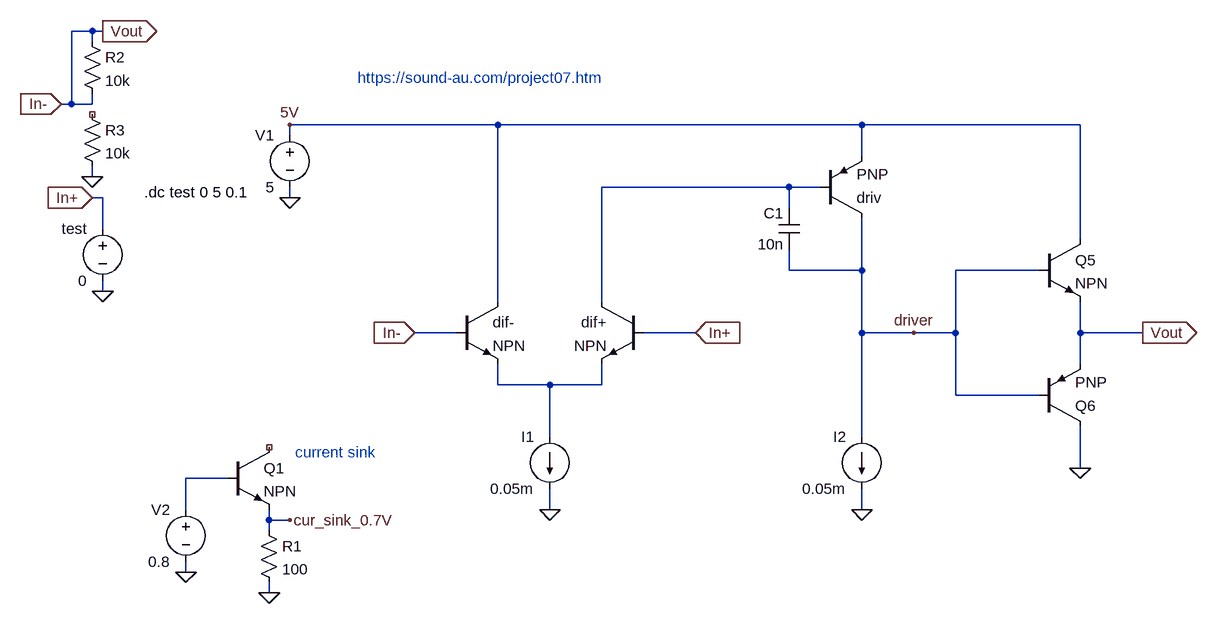
[diagram p0: schematic ideal_simple.asc]
ideal_simple.asc, the LTspice schematic file:
Version 4
SHEET 1 1104 680
WIRE -688 -384 -720 -384
WIRE -672 -384 -688 -384
WIRE -688 -368 -688 -384
WIRE -720 -272 -720 -384
WIRE -720 -272 -736 -272
WIRE -688 -272 -688 -288
WIRE -688 -272 -720 -272
WIRE -64 -240 -384 -240
WIRE 496 -240 -64 -240
WIRE 832 -240 496 -240
WIRE -384 -224 -384 -240
WIRE 496 -192 496 -240
WIRE -688 -160 -688 -176
WIRE 384 -144 96 -144
WIRE 432 -144 384 -144
WIRE -672 -128 -688 -128
WIRE -384 -128 -384 -144
WIRE 384 -112 384 -144
WIRE -672 -80 -672 -128
WIRE 832 -64 832 -240
WIRE 384 -16 384 -48
WIRE 496 -16 496 -96
WIRE 496 -16 384 -16
WIRE 768 -16 640 -16
WIRE -672 16 -672 0
WIRE -64 32 -64 -240
WIRE 96 32 96 -144
WIRE -128 80 -192 80
WIRE 240 80 160 80
WIRE 496 80 496 -16
WIRE 576 80 496 80
WIRE 640 80 640 -16
WIRE 640 80 576 80
WIRE 832 80 832 32
WIRE 928 80 832 80
WIRE 832 128 832 80
WIRE -64 160 -64 128
WIRE 16 160 -64 160
WIRE 96 160 96 128
WIRE 96 160 16 160
WIRE 640 176 640 80
WIRE 768 176 640 176
WIRE 16 240 16 160
WIRE 496 240 496 80
WIRE 832 288 832 224
WIRE -480 304 -544 304
WIRE -544 352 -544 304
WIRE 16 352 16 320
WIRE 496 352 496 320
WIRE -416 368 -416 352
WIRE -384 368 -416 368
WIRE -416 384 -416 368
WIRE -544 448 -544 432
WIRE -416 480 -416 464
FLAG -384 -128 0
FLAG -384 -240 5V
FLAG -384 368 cur_sink_0.7V
FLAG -416 480 0
FLAG -544 448 0
FLAG 832 288 0
FLAG 16 352 0
FLAG 496 352 0
FLAG 928 80 Vout
IOPIN 928 80 Out
FLAG -192 80 In-
IOPIN -192 80 In
FLAG 240 80 In+
IOPIN 240 80 In
FLAG -736 -272 In-
IOPIN -736 -272 In
FLAG -688 -128 In+
IOPIN -688 -128 In
FLAG -672 -384 Vout
IOPIN -672 -384 Out
FLAG -672 16 0
FLAG -688 -160 0
FLAG 576 80 driver
SYMBOL npn -480 256 R0
SYMATTR InstName Q1
SYMBOL res -432 368 R0
SYMATTR InstName R1
SYMATTR Value 100
SYMBOL voltage -384 -240 M0
SYMATTR InstName V1
SYMATTR Value 5
SYMBOL voltage -544 336 M0
SYMATTR InstName V2
SYMATTR Value 0.8
SYMBOL npn -128 32 R0
SYMATTR InstName dif-
SYMBOL npn 160 32 M0
SYMATTR InstName dif+
SYMBOL pnp 432 -96 M180
SYMATTR InstName driv
SYMBOL cap 400 -112 M0
SYMATTR InstName C1
SYMATTR Value 10n
SYMBOL npn 768 -64 R0
SYMATTR InstName Q5
SYMBOL pnp 768 224 M180
SYMATTR InstName Q6
SYMBOL current 16 240 M0
SYMATTR InstName I1
SYMATTR Value 0.05m
SYMBOL current 496 240 M0
SYMATTR InstName I2
SYMATTR Value 0.05m
SYMBOL voltage -672 -96 M0
SYMATTR InstName test
SYMATTR Value 0
SYMBOL res -704 -384 R0
SYMATTR InstName R2
SYMATTR Value 10k
SYMBOL res -704 -272 R0
SYMATTR InstName R3
SYMATTR Value 10k
TEXT -376 264 Left 2 ;current sink
TEXT -608 -136 Left 2 !.dc test 0 5 0.1
TEXT -280 -312 Left 2 ;https://sound-au.com/project07.htm

The netlist it stands for:
* ideal_simple.asc
Q1 NC_01 N003 cur_sink_0.7V 0 NPN
R1 cur_sink_0.7V 0 100
V1 5V 0 5
V2 N003 0 0.8
Q§dif- 5V In- N002 0 NPN
Q§dif+ N001 In+ N002 0 NPN
Q§driv driver N001 5V 0 PNP
C1 N001 driver 10n
Q5 5V driver In- 0 NPN
Q6 0 driver In- 0 PNP
I1 N002 0 0.05m
I2 driver 0 0.05m
V§test In+ 0 0
R2 In- In- 10k
R3 NC_02 0 10k
.model NPN NPN
.model PNP PNP
.lib standard.bjt
* current sink
.dc test 0 5 0.1
* https://sound-au.com/project07.htm
.backanno
.end

* Results of the author's LTspice run, read from the files saved beside the schematic
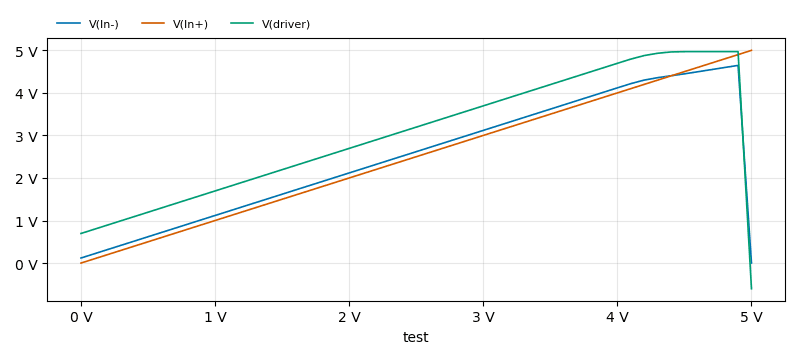
[diagram p1: DC transfer characteristic of ideal_simple.asc, plotted from the saved traces]
* DC transfer characteristic, 1 run:
*   V(In-): 118.6 mV at test=0 V, -257.2 µV at test=5 V, min -257.2 µV, max 4.646 V
*   V(In+): 0 V at test=0 V, 5 V at test=5 V, min 0 V, max 5 V
*   V(driver): 695.4 mV at test=0 V, -605.1 mV at test=5 V, min -605.1 mV, max 4.971 V